# Altium schematic sheet Alimentación.SchDoc: Alimentación
size A4; CompanyName: MUISE; Engineer: Manuel Viqueira Rodríguez; Organization: ETSI Telecomunicaciones; Address1: Av. Complutense, 30; Address2: , 28040 Madrid; Address3: Madrid; Address4: España; DocumentNumber: 5; Revision: V1.0; SheetNumber: 5; SheetTotal: 8; Engineer2: Marcos Vazquez Nuñez
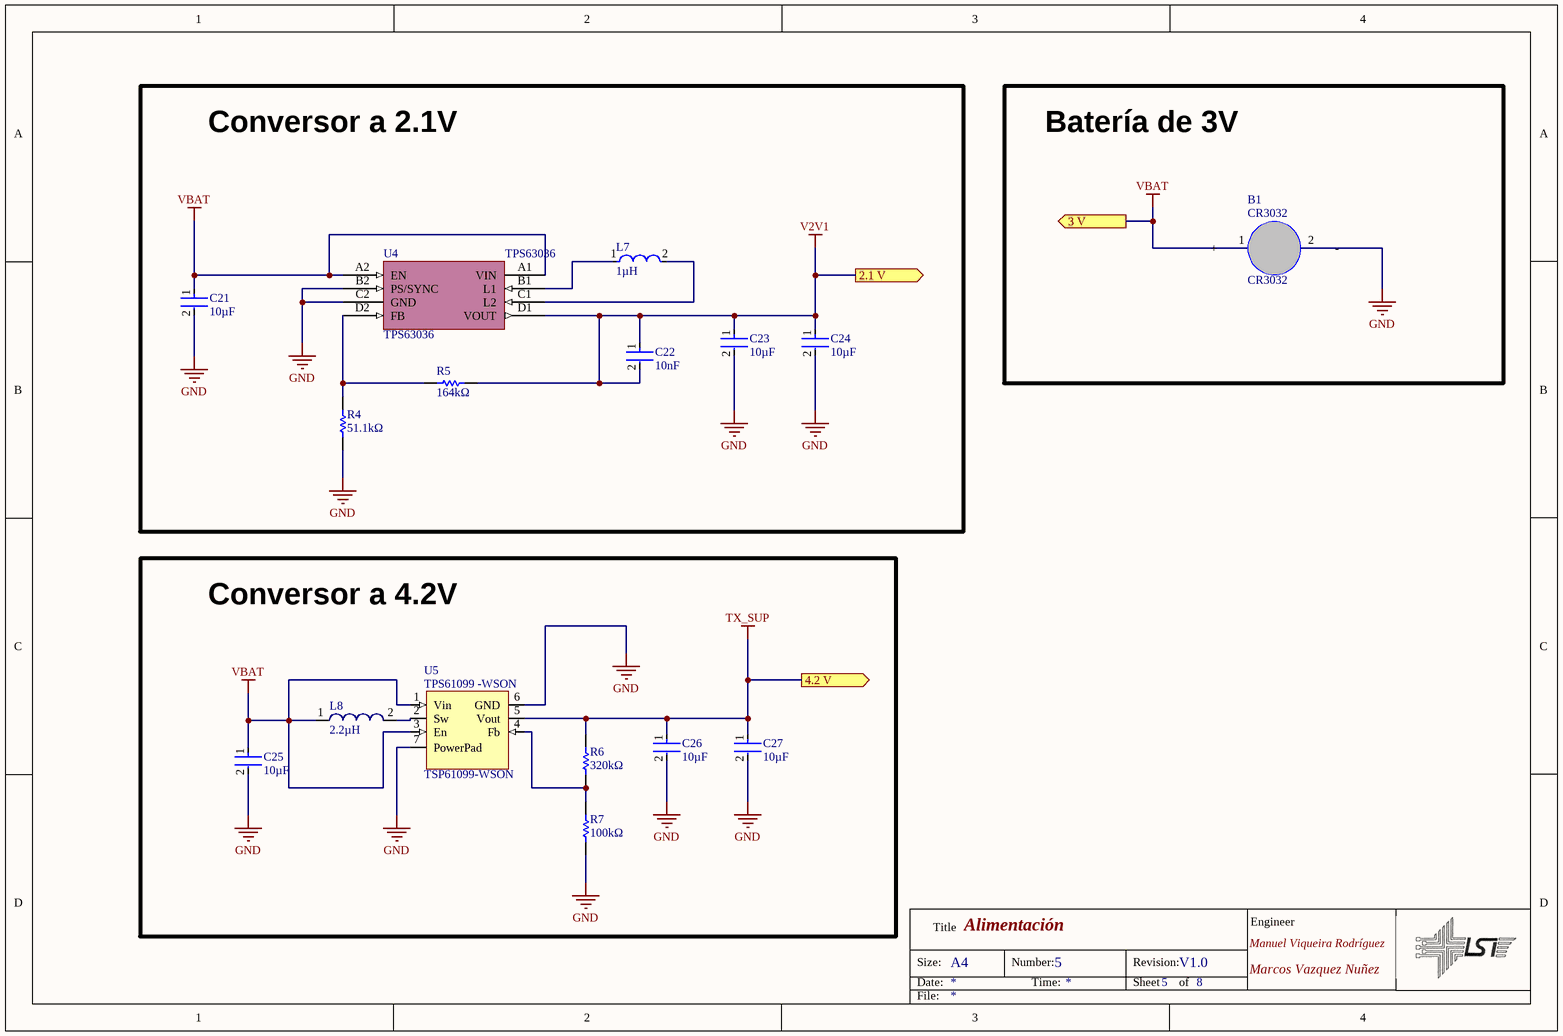
[diagram p0: Alimentación.SchDoc]

## Parts
B1  CR3032  [CR3032]
C21  10µF  [FP-CL10-IPC_B]
C22  10nF  [FP-CL10-IPC_C]
C23  10µF  [FP-CL10-IPC_B]
C24  10µF  [FP-CL10-IPC_B]
C25  10µF  [FP-CL10-IPC_B]
C26  10µF  [FP-CL10-IPC_B]
C27  10µF  [FP-CL10-IPC_B]
L7  1µH  [FP-MLZ1608-MFG]
L8  2.2µH  [SMD 2508]
R4  51.1kΩ  [RESC1005X40X25NL05T10]
R5  164kΩ  [RESC1005X40X25NL05T10]
R6  320kΩ  [RESC1005X40X25NL05T10]
R7  100kΩ  [RESC1005X40X25NL05T10]
U4  TPS63036  [tps63036]
U5  TSP61099-WSON  [SOP6]

## Blocks framed on the sheet
Conversor a 2.1V: C21-C24 L7 R4 R5 U4
Batería de 3V: B1
Conversor a 4.2V: C25-C27 L8 R6 R7 U5

## Ports
2.1 V (out), 3 V (out), 4.2 V (out)

## Nets
GND: B1.2(-) C21.2 C23.2 C24.2 C25.2 C26.2 C27.2 R4.1 R7.1 U4.B2(PS/SYNC) U4.C2(GND) U5.6(GND) U5.7(PowerPad)
TX_SUP: C26.1 C27.1 R6.2 U5.5(Vout) ; port 4.2 V
V2V1: C22.1 C22.2 C23.1 C24.1 R5.2 U4.D1(VOUT) ; port 2.1 V
VBAT: B1.1(+) C21.1 C25.1 L8.1 U4.A1(VIN) U4.A2(EN) U5.1(Vin) U5.3(En) ; port 3 V
NetL7_1: L7.1 U4.B1(L1)
NetL7_2: L7.2 U4.C1(L2)
NetL8_2: L8.2 U5.2(Sw)
NetR4_2: R4.2 R5.1 U4.D2(FB)
NetR6_1: R6.1 R7.2 U5.4(Fb)

## Notes on the sheet
- Size:
- Date:
- Title
- A4
- Number:
- Time:
- Revision:
- Sheet
- of
- Engineer
- File:
- (in symbol TSP61099-WSON) TPS61099 -WSON

## Library data of the parts
C21 C23-C27 = CMP-13271-003245-1: Cap Ceramic 10uF 10V X5R ±10% Pad SMD 0603 +85°C T/R; Packaging: Tape and Reel; Dielectric: X5R; Min Operating Temperature: -55°C; Lead Free: Lead Free; Height: 0.8mm; Package Quantity: 10000; Voltage Rating (DC): 10V; Mount: Surface Mount; Tolerance: 10%; Width: 0.031inch; Thickness: 0.035inch; Depth: 0.8mm; Max Operating Temperature: 85°C; Capacitance: 10uF; Case/Package: 0603; Length: 1.6mm; Voltage Rating: 10V; Radiation Hardening: No
C22 = CMP-13271-000193-1: Cap Ceramic 10nF 50V X7R ±20% Pad SMD 0603 +125°C T/R; Voltage Rating (DC): 50V; Radiation Hardening: No; Packaging: Tape and Reel; Depth: 0.8mm; Package Quantity: 4000; Max Operating Temperature: 125°C; Length: 1.6mm; Voltage Rating: 50V; Case/Package: 0603; Dielectric: X7R; Mount: Surface Mount; Tolerance: 20%; Thickness: 0.035inch; Capacitance: 10nF; Height: 0.8mm; Lead Free: Lead Free; Case Code (Metric): 1608; Width: 0.031inch; Min Operating Temperature: -55°C; Case Code (Imperial): 0603
L7 = CMP-08253-000001-1: FIXED IND 1UH 600MA 150 MOHM SMD; Manufacturer Part Number: MLZ1608A1R0WT000; Manufacturer: TDK; Core Material: Ferrite; Series Resistance: 0.195Ω; Tolerance: 20%; Saturation Current: 190mA; Test Frequency: 10MHz; Shielding: true; Height: 0.95mm; Category: Ind; Value: 1uH; Device Class L2: Inductors; Lead Free: Yes; Automotive: No; RoHS: TRUE; Device Class L1: Passive Components; Package: MLZ1608; Inductance: 1uH; Temperature Range High: +125°C; Ipc Land Pattern Name: CAPC16080X80; Composition: Multilayer; Mouser Description: Inductor Power Shielded Multi-Layer 1uH 20% 10MHz Ferrite 0.19A 0.195Ohm DCR 0603 T/R; ComponentLink2Description: Datasheet; Digikey Description: FIXED IND 1UH 600MA 150 MOHM SMD; Temperature Range Low: -55°C; Temperature: -55°C to +125°C; Device Class L3: Fixed Inductors; Octopart: https://octopart.com/mlz1608a1r0wt000-tdk-34829250; ComponentLink2URL: https://product.tdk.com/info/en/catalog/datasheets/inductor_commercial_decoupling_mlz1608_en.pdf
L8 = CMP-1411-00004-1: Power Multilayer Inductor WE-MAPI, L=2.2µH; PartNumber: 74438322022; Manufacturer: Wuerth Elektronik; Inductance: 2.2ÂµH; ComponentLink2URL: http://katalog.we-online.de/kataloge/eisos/media/pdf/74438322022.pdf; ComponentLink1Description: Manufacturer URL; ComponentLink2Description: Datasheet; ComponentLink1URL: http://www.we-online.com; PackageReference: SMD 2508
R4-R7 = CMP-2002-06462-1: Part Number: ERJ-U02F1501X; Manufacturer: Panasonic
U4 = TPS63036: Non-inverting buck-boost / converter able to provide a regulated output voltage / from an input supply that can be higher or lower than / the output voltage